# Altium schematic sheet sch.SchDoc
size A3; SheetNumber: 1; SheetTotal: 1
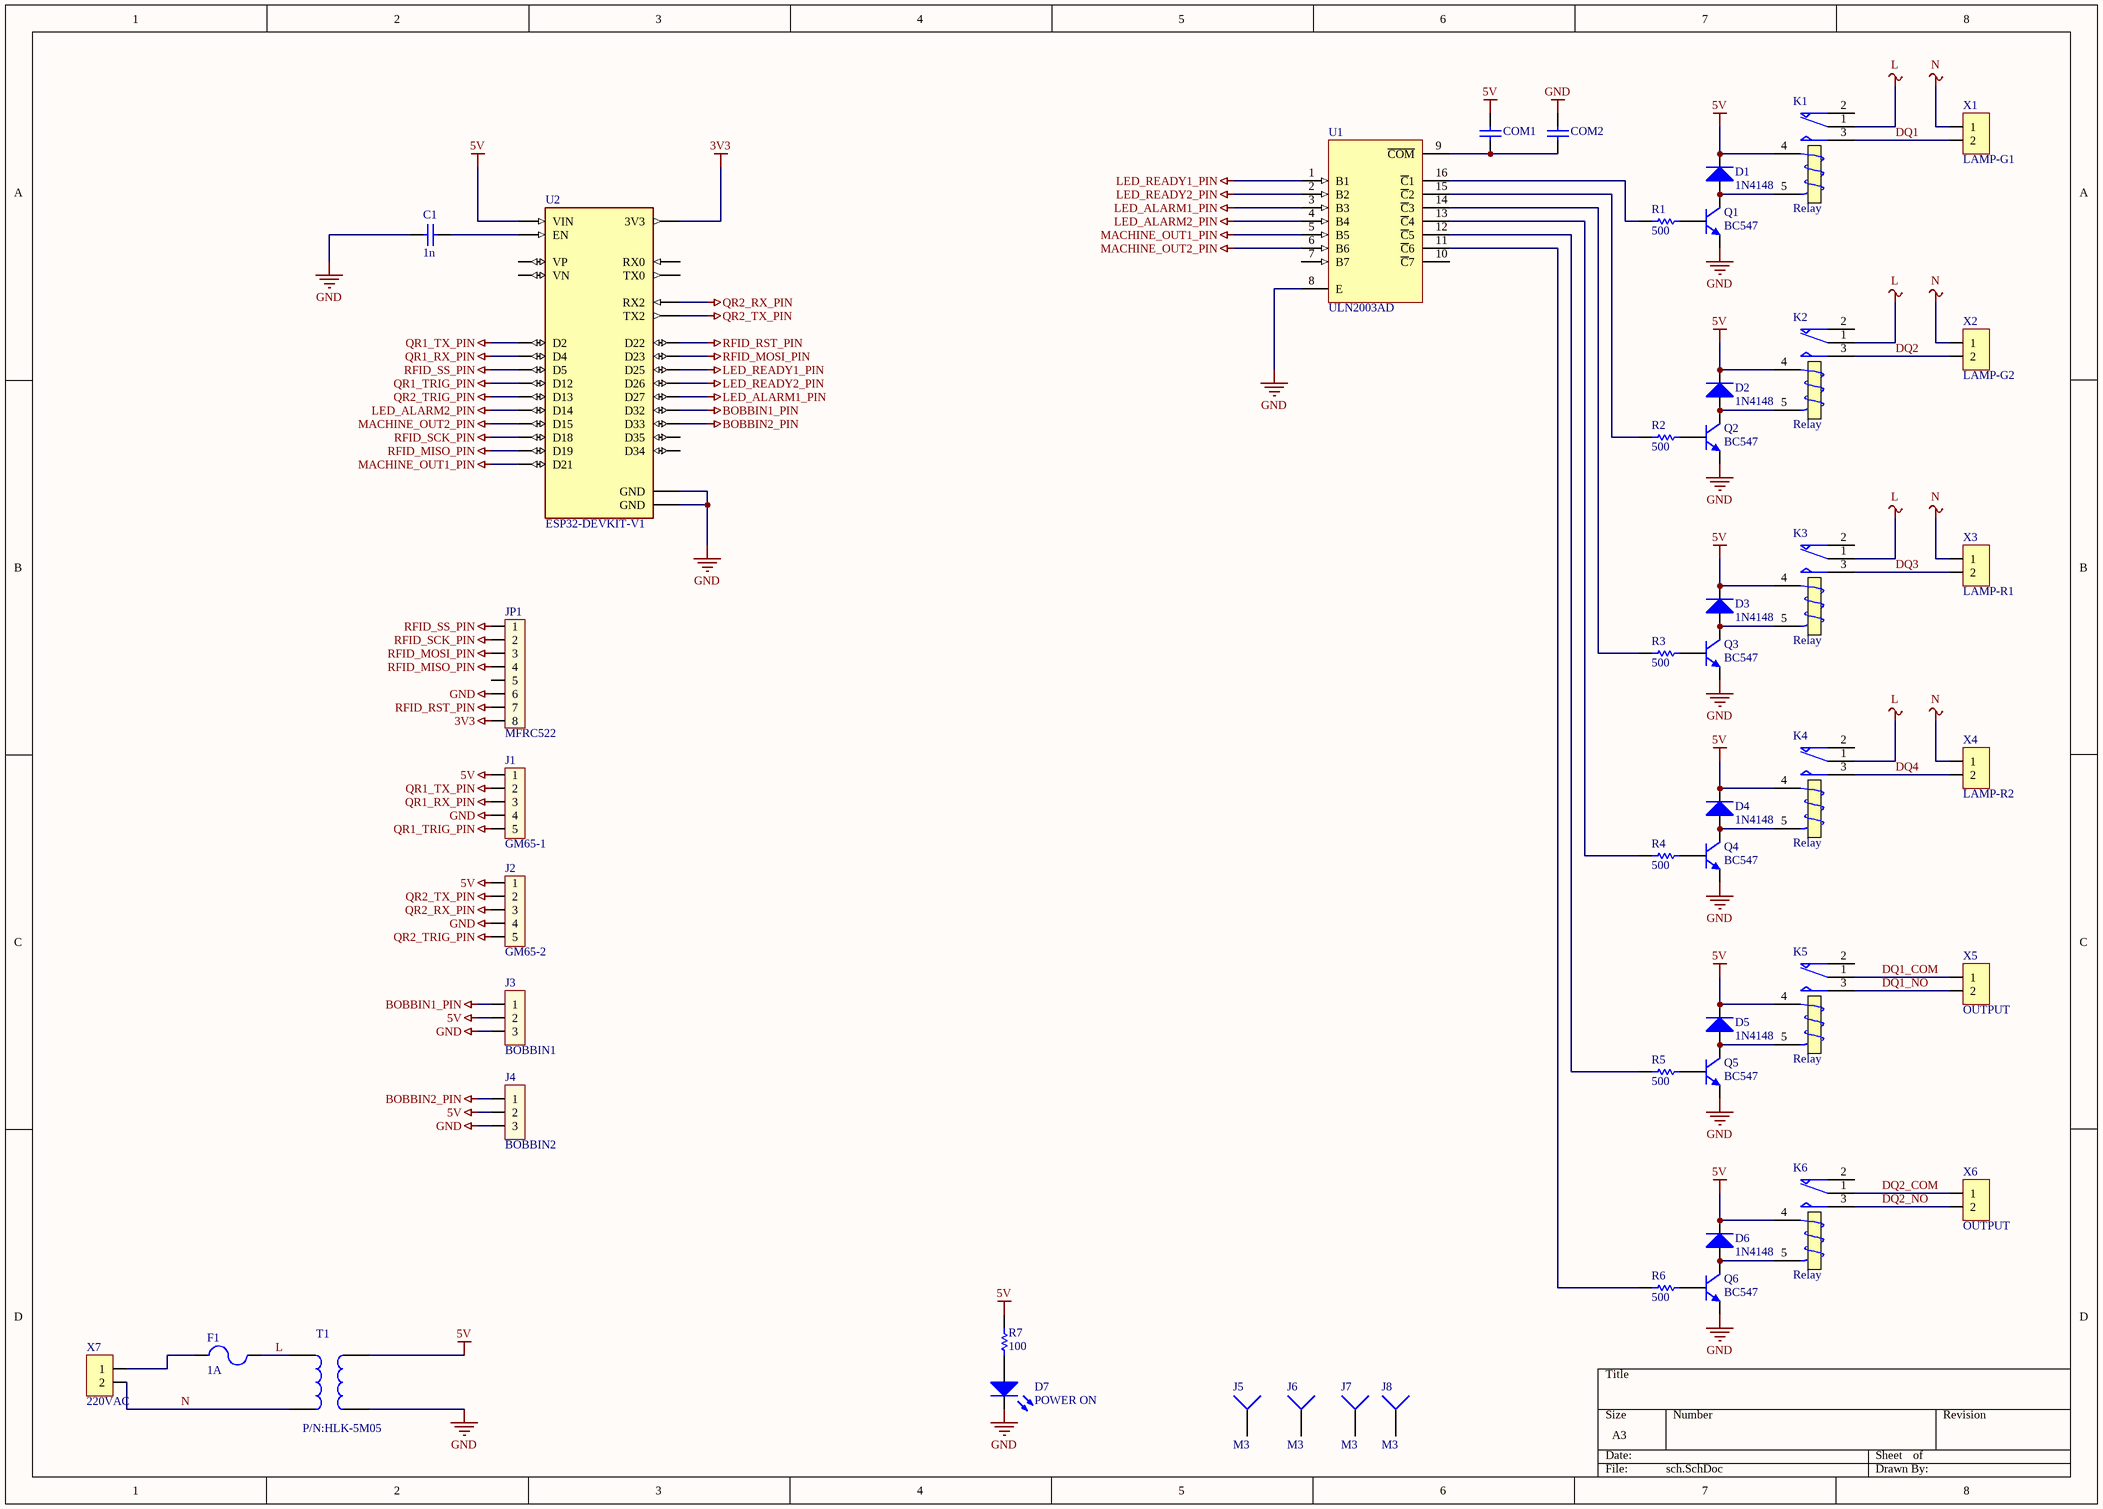
[diagram p0: sch.SchDoc]

## Parts
C1  1n  [CR2012-0805]
COM1  (no value)  [CR2012-0805]
COM2  (no value)  [CR2012-0805]
D1  1N4148  [D4148]
D2  1N4148  [D4148]
D3  1N4148  [D4148]
D4  1N4148  [D4148]
D5  1N4148  [D4148]
D6  1N4148  [D4148]
D7  POWER ON  [LED]
F1  1A  [CAP5W]
J1  GM65-1  [CONNECT_2.54_(5)]
J2  GM65-2  [CONNECT_2.54_(5)]
J3  BOBBIN1  [CONNECT_W(3)]
J4  BOBBIN2  [CONNECT_W(3)]
J5  M3  [PAD]
J6  M3  [PAD]
J7  M3  [PAD]
J8  M3  [PAD]
JP1  MFRC522  [SIP8]
K1  Relay  [RELAY1CON_REV]
K2  Relay  [RELAY1CON_REV]
K3  Relay  [RELAY1CON_REV]
K4  Relay  [RELAY1CON_REV]
K5  Relay  [RELAY1CON_REV]
K6  Relay  [RELAY1CON_REV]
Q1  BC547  [TO-92]
Q2  BC547  [TO-92]
Q3  BC547  [TO-92]
Q4  BC547  [TO-92]
Q5  BC547  [TO-92]
Q6  BC547  [TO-92]
R1  500  [R1/8]
R2  500  [R1/8]
R3  500  [R1/8]
R4  500  [R1/8]
R5  500  [R1/8]
R6  500  [R1/8]
R7  100  [R1/8]
T1  P/N:HLK-5M05  [HLK-PM01]
U1  ULN2003AD  [D016_N]
U2  ESP32-DEVKIT-V1  [ESP32-30PIN]
X1  LAMP-G1  [KF142V-5.08-P2]
X2  LAMP-G2  [KF142V-5.08-P2]
X3  LAMP-R1  [KF142V-5.08-P2]
X4  LAMP-R2  [KF142V-5.08-P2]
X5  OUTPUT  [KF142V-5.08-P2]
X6  OUTPUT  [KF142V-5.08-P2]
X7  220VAC  [KF142V-5.08-P2]

## Nets
3V3: JP1.8 U2.1(3V3)
5V: COM1.2 D1.K D2.K D3.K D4.K D5.K D6.K J1.1 J2.1 J3.2 J4.2 K1.4(T1) K2.4(T1) K3.4(T1) K4.4(T1) K5.4(T1) K6.4(T1) R7.1 T1.4 U2.30(VIN)
BOBBIN1_PIN: J3.1 U2.21(D32)
BOBBIN2_PIN: J4.1 U2.22(D33)
GND: C1.1 COM2.2 D7.2(K) J1.4 J2.4 J3.3 J4.3 JP1.6 Q1.3(E) Q2.3(E) Q3.3(E) Q4.3(E) Q5.3(E) Q6.3(E) T1.3 U1.8(E) U2.2(GND) U2.29(GND)
L: F1.2 K1.1(COM) K2.1(COM) K3.1(COM) K4.1(COM) T1.2
LED_ALARM1_PIN: U1.3(B3) U2.25(D27)
LED_ALARM2_PIN: U1.4(B4) U2.26(D14)
LED_READY1_PIN: U1.1(B1) U2.23(D25)
LED_READY2_PIN: U1.2(B2) U2.24(D26)
MACHINE_OUT1_PIN: U1.5(B5) U2.11(D21)
MACHINE_OUT2_PIN: U1.6(B6) U2.3(D15)
N: T1.1 X1.1 X2.1 X3.1 X4.1 X7.2
QR1_RX_PIN: J1.3 U2.5(D4)
QR1_TRIG_PIN: J1.5 U2.27(D12)
QR1_TX_PIN: J1.2 U2.4(D2)
QR2_RX_PIN: J2.3 U2.6(RX2)
QR2_TRIG_PIN: J2.5 U2.28(D13)
QR2_TX_PIN: J2.2 U2.7(TX2)
RFID_MISO_PIN: JP1.4 U2.10(D19)
RFID_MOSI_PIN: JP1.3 U2.15(D23)
RFID_RST_PIN: JP1.7 U2.14(D22)
RFID_SCK_PIN: JP1.2 U2.9(D18)
RFID_SS_PIN: JP1.1 U2.8(D5)
DQ1: K1.3(NO) X1.2
DQ1_COM: K5.1(COM) X5.1
DQ1_NO: K5.3(NO) X5.2
DQ2: K2.3(NO) X2.2
DQ2_COM: K6.1(COM) X6.1
DQ2_NO: K6.3(NO) X6.2
DQ3: K3.3(NO) X3.2
DQ4: K4.3(NO) X4.2
NetC1_2: C1.2 U2.16(EN)
NetCOM1_1: COM1.1 COM2.1 U1.9(~{COM})
NetD1_A: D1.A K1.5(T2) Q1.1(C)
NetD2_A: D2.A K2.5(T2) Q2.1(C)
NetD3_A: D3.A K3.5(T2) Q3.1(C)
NetD4_A: D4.A K4.5(T2) Q4.1(C)
NetD5_A: D5.A K5.5(T2) Q5.1(C)
NetD6_A: D6.A K6.5(T2) Q6.1(C)
NetD7_1: D7.1(A) R7.2
NetF1_1: F1.1 X7.1
NetQ1_2: Q1.2(B) R1.1
NetQ2_2: Q2.2(B) R2.1
NetQ3_2: Q3.2(B) R3.1
NetQ4_2: Q4.2(B) R4.1
NetQ5_2: Q5.2(B) R5.1
NetQ6_2: Q6.2(B) R6.1
NetR1_2: R1.2 U1.16(~{C}1)
NetR2_2: R2.2 U1.15(~{C}2)
NetR3_2: R3.2 U1.14(~{C}3)
NetR4_2: R4.2 U1.13(~{C}4)
NetR5_2: R5.2 U1.12(~{C}5)
NetR6_2: R6.2 U1.11(~{C}6)

Not connected (* = marked no-connect by the designer): J5 1; J6 1; J7 1; J8 1; JP1 5; K1 2(NC); K2 2(NC); K3 2(NC); K4 2(NC); K5 2(NC); K6 2(NC); U1 7(B7) 10(~{C}7); U2 12(RX0) 13(TX0) 17(VP) 18(VN) 19(D34) 20(D35)

## Library data of the parts
C1 = Cap: Capacitor; Published: 8-Jun-2000; LatestRevisionDate: 17-Jul-2002; LatestRevisionNote: Re-released for DXP Platform.; PackageReference: RAD-0.3; Publisher: Altium Limited; PackageDescription: Radial Cap, Thru-Hole; 2 Leads; 0.3 in Pin Spacing; Value: 1n
COM1 COM2 = Cap: Capacitor; Value: 1n; Published: 8-Jun-2000; LatestRevisionDate: 17-Jul-2002; LatestRevisionNote: Re-released for DXP Platform.; PackageReference: RAD-0.3; Publisher: Altium Limited; PackageDescription: Radial Cap, Thru-Hole; 2 Leads; 0.3 in Pin Spacing
D1-D6 = Diode: Default Diode; Published: 8-Jun-2000; LatestRevisionDate: 17-Jul-2002; LatestRevisionNote: Re-released for DXP Platform.; PackageVersion: Sep-1996; PackageReference: SMC; Publisher: Altium Limited; PackageDescription: DO-214-AB/SMC; 2 C-Bend Leads; Body 7.9 x 5.9 mm, inc. leads (LxW); Code_JEDEC: DO-214-AB
D7 = LED0: Typical INFRARED GaAs LED; Published: 8-Jun-2000; LatestRevisionDate: 08-Jul-2005; LatestRevisionNote: Mech Layer 1 removed.; PackageReference: LED-0; Publisher: Altium Limited; PackageDescription: LED; 2 Leads
F1 = Fuse 2: Fuse; Published: 8-Jun-2000; LatestRevisionDate: 17-Jul-2002; LatestRevisionNote: Re-released for DXP Platform.; PackageReference: PIN-W2/E2.8; Publisher: Altium Limited; PackageDescription: Thru-Hole; 2 Leads
J1 J2 = JP5
J3 J4 = JP3: Jumper 3; Value: J3
J5-J8 = Socket: LatestRevisionDate: 17-Jul-2002; LatestRevisionNote: Re-released for DXP Platform.; Publisher: Altium Limited
JP1 = JP8: JP8 PIN; Value: JP7
K1-K6 = Relay: SPDT Relay; Published: 8-Jun-2000; LatestRevisionDate: 17-Jul-2002; LatestRevisionNote: Re-released for DXP Platform.; PackageReference: MODULE5B; Publisher: Altium Limited
Q1-Q6 = 2N3904: NPN General Purpose Amplifier; Published: 8-Jun-2000; LatestRevisionDate: 15-Jan-2003; LatestRevisionNote: PCB Footprint 'BCY-W3/D4.7' replaced; DatasheetVersion: 1997; PackageVersion: Sep-1998; PackageReference: TO-92A; Publisher: Altium Limited; PackageDescription: TO, Flat Index; 3 In-Line, Axial Leads; Body Dia. 4.5mm; Leads 0.51 x 0.48 mm (max); ComponentLink1Description: Manufacturer Link; ComponentLink1URL: http://www.fairchildsemi.com/; ComponentLink2Description: Datasheet; ComponentLink2URL: http://www.fairchildsemi.com/ds/2N%2F2N3904.pdf
R1-R7 = Res1: Resistor; Value: 1K; Published: 8-Jun-2000; LatestRevisionDate: 17-Jul-2002; LatestRevisionNote: Re-released for DXP Platform.; PackageReference: AXIAL-0.3; Publisher: Altium Limited; PackageDescription: Axial Device, Thru-Hole; 2 Leads; 0.3 in Pin Spacing
T1 = Trans: Transformer; Published: 24-Mar-1999; LatestRevisionDate: 08-Jul-2005; LatestRevisionNote: Mech Layer 1 removed.; PackageReference: TRANS; Publisher: Altium Limited; PackageDescription: Transformer; 4 Leads
U1 = ULN2003AD: Darlington Transistor Array; Published: 15-May-2002; LatestRevisionDate: 13-Apr-2006; LatestRevisionNote: IPC-7351 Footprint Added.; DatasheetVersion: Sep-1986; PackageVersion: Jan-1998; PackageReference: D016; Publisher: Altium Limited; PackageDescription: 16-Pin Small Outline Integrated Circuit 1.27 mm Pitch; Code_IPC: SOIC127P600-16; ComponentLink1Description: Manufacturer Link; ComponentLink1URL: http://www.ti.com/; ComponentLink2Description: Datasheet; ComponentLink2URL: http://www-s.ti.com/sc/ds/uln2002a.pdf
U2 = ESP32-DEVKIT-V1: Dual core, Wi-Fi: 2.4 GHz up to 150 Mbits/s,BLE (Bluetooth Low Energy) and legacy Bluetooth, 32 bits, Up to 240 MHz
X1-X7 = JP2: WR-PHD 2.54 mm Angled Socket Header; Manufacturer: W¨¹rth Elektronik eiSos GmbH; partNo: 613002143121; ComponentLink1 Description: Manufacturer; ComponentLink2 Description: Datasheet; NoPins: 02; Created Date: 29 March 2013; ComponentLink1URL: http://www.we-online.com; ComponentLink2URL: http://katalog.we-online.de/em/datasheet/6130xx143121.pdf; Created by: Karrer Zheng